# Altium schematic sheet MP3-TF.SchDoc
size A4
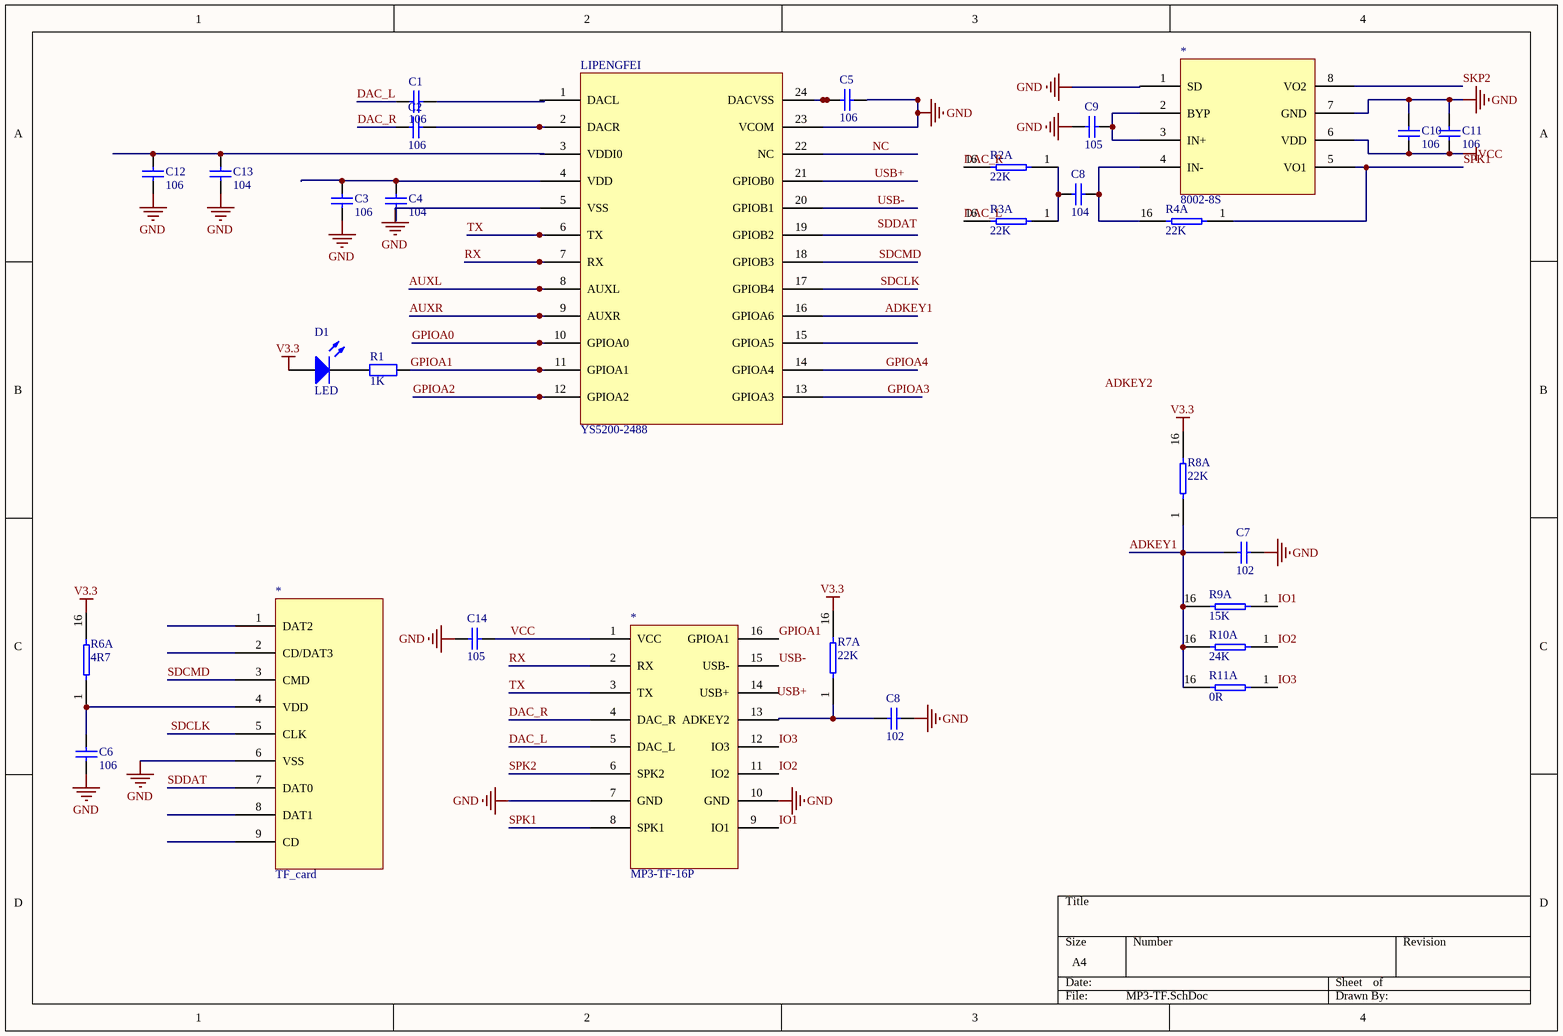
[diagram p0: MP3-TF.SchDoc]

## Parts
(Parts that share a designator on the sheet are numbered #1, #2 ... from top to bottom, then left to right.)
*#1  8002-8S
*#2  MP3-TF-16P
*#3  TF_card
C1  106  [RAD-0.3]
C2  106  [RAD-0.3]
C3  106  [RAD-0.3]
C4  104  [RAD-0.3]
C5  106  [RAD-0.3]
C6  106  [RAD-0.3]
C7  102  [RAD-0.3]
C8#1  104  [RAD-0.3]
C8#2  102  [RAD-0.3]
C9  105  [RAD-0.3]
C10  106  [RAD-0.3]
C11  106  [RAD-0.3]
C12  106  [RAD-0.3]
C13  104  [RAD-0.3]
C14  105  [RAD-0.3]
D1  LED  [LED-0]
LIPENGFEI  YS5200-2488
R1  1K  [AXIAL-0.4]
R2  22K  [DIP-16]  (part A of 8)
R3  22K  [DIP-16]  (part A of 8)
R4  22K  [DIP-16]  (part A of 8)
R6  4R7  [DIP-16]  (part A of 8)
R7  22K  [DIP-16]  (part A of 8)
R8  22K  [DIP-16]  (part A of 8)
R9  15K  [DIP-16]  (part A of 8)
R10  24K  [DIP-16]  (part A of 8)
R11  0R  [DIP-16]  (part A of 8)

## Nets
GND: *#1.1(SD) *#1.7(GND) *#2.7(GND) *#2.10(GND) *#3.6(VSS) C3.1 C5.1 C6.1 C7.1 C8#2.1 C9.2 C10.2 C11.2 C12.1 C13.1 C14.2 LIPENGFEI.5(VSS) LIPENGFEI.23(VCOM)
V3.3: D1.1(A) R6.16 R7.16 R8.16
VCC: *#1.6(VDD) *#2.1(VCC) C10.1 C11.1 C14.1
ADKEY1: C7.2 LIPENGFEI.16(GPIOA6) R8.1 R9.16 R10.16 R11.16
AUXL: LIPENGFEI.8(AUXL)
AUXR: LIPENGFEI.9(AUXR)
DAC_L: *#2.5(DAC_L) C1.2 R3.16
DAC_R: *#2.4(DAC_R) C2.2 R2.16
GPIOA0: LIPENGFEI.10(GPIOA0)
GPIOA1: *#2.16(GPIOA1) LIPENGFEI.11(GPIOA1) R1.2
GPIOA2: LIPENGFEI.12(GPIOA2)
GPIOA3: LIPENGFEI.13(GPIOA3)
GPIOA4: LIPENGFEI.14(GPIOA4)
IO1: *#2.9(IO1) R9.1
IO2: *#2.11(IO2) R10.1
IO3: *#2.12(IO3) R11.1
NC: LIPENGFEI.22(NC)
RX: *#2.2(RX) LIPENGFEI.7(RX)
SDCLK: *#3.5(CLK) LIPENGFEI.17(GPIOB4)
SDCMD: *#3.3(CMD) LIPENGFEI.18(GPIOB3)
SDDAT: *#3.7(DAT0)
SKP2: *#1.8(VO2)
SPK1: *#1.5(VO1) *#2.8(SPK1) R4.1
SPK2: *#2.6(SPK2)
TX: *#2.3(TX) LIPENGFEI.6(TX)
USB+: LIPENGFEI.21(GPIOB0)
USB-: *#2.15(USB-) LIPENGFEI.20(GPIOB1)
Net*#1_2: *#1.2(BYP) *#1.3(IN+) C9.1
Net*#1_4: *#1.4(IN-) C8#1.1 R4.16
Net*#2_13: *#2.13(ADKEY2) C8#2.2 R7.1
Net*#3_4: *#3.4(VDD) C6.2 R6.1
NetC2_1: C2.1 LIPENGFEI.2(DACR)
NetC3_2: C3.2 C4.2 LIPENGFEI.4(VDD)
NetC5_2: C5.2 LIPENGFEI.24(DACVSS)
NetC8#1_2: C8#1.2 R2.1 R3.1
NetC12_2: C12.2 C13.2 LIPENGFEI.3(VDDI0)
NetD1_2: D1.2(K) R1.1

Not connected (* = marked no-connect by the designer): *#2 14(USB+); *#3 1(DAT2) 2(CD/DAT3) 8(DAT1) 9(CD); C1 1; C4 1; LIPENGFEI 1(DACL) 15(GPIOA5) 19(GPIOB2)

## Notes on the sheet
- Labels drawn without touching a wire or pin: ADKEY2, SDDAT, USB+

## Library data of the parts
C1-C7 C8#1 C8#2 C9-C14 = Cap: Capacitor; Value: 100pF; Published: 8-Jun-2000; LatestRevisionDate: 17-Jul-2002; LatestRevisionNote: Re-released for DXP Platform.; PackageReference: RAD-0.3; Publisher: Altium Limited; PackageDescription: Radial Cap, Thru-Hole; 2 Leads; 0.3 in Pin Spacing
D1 = LED0: Typical INFRARED GaAs LED; Published: 8-Jun-2000; LatestRevisionDate: 08-Jul-2005; LatestRevisionNote: Mech Layer 1 removed.; PackageReference: LED-0; Publisher: Altium Limited; PackageDescription: LED; 2 Leads
R1 = Res2: Resistor; Published: 8-Jun-2000; LatestRevisionDate: 17-Jul-2002; LatestRevisionNote: Re-released for DXP Platform.; PackageReference: AXIAL-0.4; Publisher: Altium Limited; PackageDescription: Axial Device, Thru-Hole; 2 Leads; 0.4 in Pin Spacing; Value: 1K
R2-R4 R6-R11 = Res Pack2: Isolated Resistor Network - Parts; Sim Note: Enter the Resistance value into parameter field.; Value: 1K; Published: 24-Mar-1999; LatestRevisionDate: 17-Jul-2002; LatestRevisionNote: Re-released for DXP Platform.; PackageReference: DIP-16; Publisher: Altium Limited; Code_JEDEC: MO-001-AC